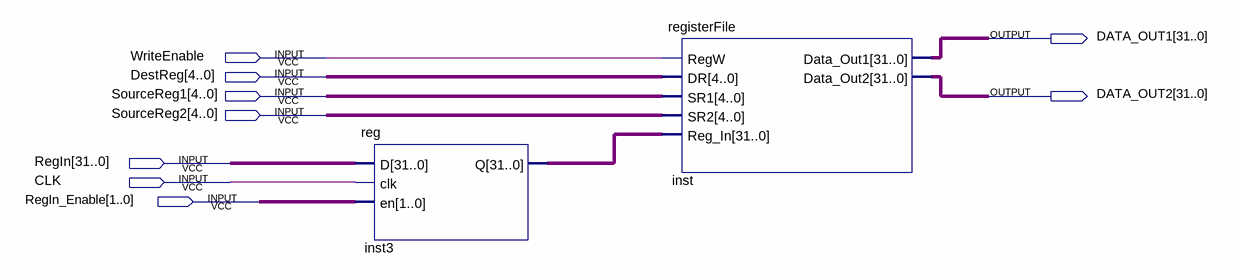
[diagram p0: schematic sheet]
// Quartus schematic RegFile_Block.bdf as structural Verilog: 2 symbols, 9 pins
module RegFile_Block (
  input  WriteEnable,
  input  [4:0] DestReg,
  input  [4:0] SourceReg1,
  input  [4:0] SourceReg2,
  input  [31:0] RegIn,
  input  CLK,
  input  [1:0] RegIn_Enable,
  output [31:0] DATA_OUT1,
  output [31:0] DATA_OUT2
);

  wire [31:0] inst3_q;

  \reg  inst3 (.D(RegIn), .clk(CLK), .en(RegIn_Enable), .Q(inst3_q));
  registerFile inst (
    .RegW(WriteEnable), .DR(DestReg), .SR1(SourceReg1), .SR2(SourceReg2), .Reg_In(inst3_q),
    .Data_Out1(DATA_OUT1), .Data_Out2(DATA_OUT2));
endmodule
